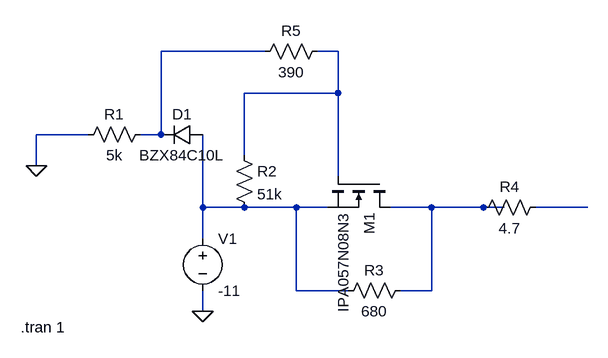
[diagram p0: schematic Draft1.asc]
Draft1.asc, the LTspice schematic file:
Version 4.1
SHEET 1 900 680
WIRE 400 0 240 0
WIRE 512 0 480 0
WIRE 512 64 512 0
WIRE 512 64 368 64
WIRE 128 128 48 128
WIRE 240 128 240 0
WIRE 240 128 208 128
WIRE 368 160 368 64
WIRE 48 176 48 128
WIRE 512 192 512 64
WIRE 304 240 304 128
WIRE 368 240 304 240
WIRE 448 240 368 240
WIRE 496 240 448 240
WIRE 656 240 592 240
WIRE 736 240 656 240
WIRE 768 240 736 240
WIRE 896 240 816 240
WIRE 304 288 304 240
WIRE 448 368 448 240
WIRE 528 368 448 368
WIRE 656 368 656 240
WIRE 656 368 608 368
WIRE 304 400 304 368
FLAG 48 176 0
FLAG 304 400 0
SYMBOL res 224 112 R90
WINDOW 0 0 56 VBottom 2
WINDOW 3 32 56 VTop 2
SYMATTR InstName R1
SYMATTR Value 5k
SYMBOL diode 304 112 R90
WINDOW 0 0 32 VBottom 2
WINDOW 3 32 32 VTop 2
SYMATTR InstName D1
SYMATTR Value BZX84C10L
SYMATTR Description Diode
SYMATTR Type diode
SYMBOL res 352 144 R0
SYMATTR InstName R2
SYMATTR Value 51k
SYMBOL nmos 592 192 R90
SYMATTR InstName M1
SYMATTR Value IPA057N08N3
SYMBOL res 624 352 R90
WINDOW 0 0 56 VBottom 2
WINDOW 3 32 56 VTop 2
SYMATTR InstName R3
SYMATTR Value 680
SYMBOL res 832 224 R90
WINDOW 0 0 56 VBottom 2
WINDOW 3 32 56 VTop 2
SYMATTR InstName R4
SYMATTR Value 4.7
SYMBOL voltage 304 272 R0
WINDOW 123 0 0 Left 0
WINDOW 39 0 0 Left 0
SYMATTR InstName V1
SYMATTR Value -11
SYMBOL res 496 -16 R90
WINDOW 0 0 56 VBottom 2
WINDOW 3 32 56 VTop 2
SYMATTR InstName R5
SYMATTR Value 390
TEXT 24 424 Left 2 !.tran 1

The netlist it stands for:
* Draft1.asc
R1 N001 0 5k
D1 N003 N001 BZX84C10L
R2 N002 N003 51k
M1 N004 N002 N003 N003 IPA057N08N3
R3 N004 N003 680
R4 N005 N004 4.7
V1 N003 0 -11
R5 N002 N001 390
.model D D
.lib standard.dio
.model NMOS NMOS
.model PMOS PMOS
.lib standard.mos
.tran 1
.backanno
.end